# Altium schematic sheet 0-99_Counter.SchDoc
size A; SheetNumber: 1; SheetTotal: 2
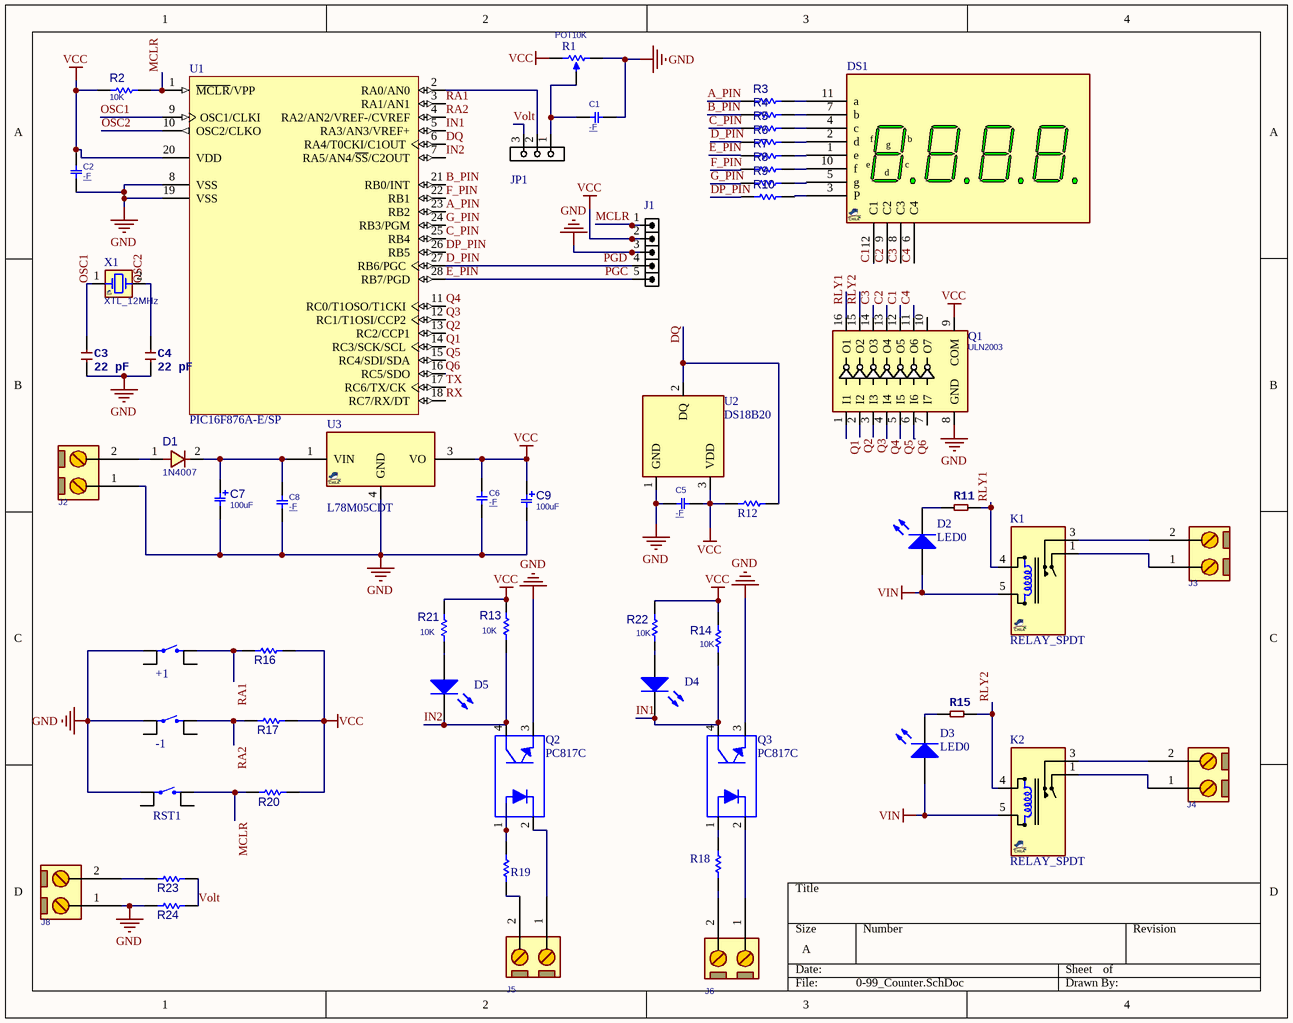
[diagram p0: 0-99_Counter.SchDoc]

## Parts
+1  Tactile 4PIN 6X6mm H5mm (THD)  [SWPBT_SPDT_6X6X5SKHH]  (value not drawn)
-1  Tactile 4PIN 6X6mm H5mm (THD)  [SWPBT_SPDT_6X6X5SKHH]  (value not drawn)
C1  -F  [C0805]
C2  -F  [C0805]
C3  22 pF  [C0603]
C4  22 pF  [C0603]
C5  -F  [C0805]
C6  -F  [C0805]
C7  100uF  [C_EL_10X12]
C8  -F  [C0805]
C9  100uF  [C_EL_10X12]
D1  1N4007  [D_AX04_DO41]
D2  LED0  [LED3MM]
D3  LED0  [LED3MM]
D4  LED1  [LED3MM]  (value not drawn)
D5  LED1  [LED3MM]  (value not drawn)
DS1  7SEG_4DIGIT_CC  [7SEGX4_12]  (value not drawn)
J1  HDR1X5  [HDR_M_1X5]  (value not drawn)
J2  CONN_TB2  [TBG_2]  (value not drawn)
J3  CONN_TB2  [TBG_2]  (value not drawn)
J4  CONN_TB2  [TBG_2]  (value not drawn)
J5  CONN_TB2  [TBG_2]  (value not drawn)
J6  CONN_TB2  [TBG_2]  (value not drawn)
J8  CONN_TB2  [TBG_2]  (value not drawn)
JP1  JMPHDR3PIN  [JP_3]  (value not drawn)
K1  RELAY_SPDT  [REL_SPDT_5_2216]
K2  RELAY_SPDT  [REL_SPDT_5_2216]
Q1  ULN2003  [DIP_16]
Q2  PC817C  [DIP762W50P254L650H458Q4B]
Q3  PC817C  [DIP762W50P254L650H458Q4B]
R1  POT10K  [VOL_R]
R2  10K  [R0805]
R3  10K  [R0805]  (value not drawn)
R4  10K  [R0805]  (value not drawn)
R5  10K  [R0805]  (value not drawn)
R6  10K  [R0805]  (value not drawn)
R7  10K  [R0805]  (value not drawn)
R8  10K  [R0805]  (value not drawn)
R9  10K  [R0805]  (value not drawn)
R10  10K  [R0805]  (value not drawn)
R11  (no value)  [R0805]
R12  10K  [R0805]  (value not drawn)
R13  10K  [R0805]
R14  10K  [R0805]
R15  (no value)  [R0805]
R16  10K  [R0805]  (value not drawn)
R17  10K  [R0805]  (value not drawn)
R18  10K  [R0805]  (value not drawn)
R19  10K  [R0805]  (value not drawn)
R20  10K  [R0805]  (value not drawn)
R21  10K  [R0805]
R22  10K  [R0805]
R23  10K  [R0805]  (value not drawn)
R24  10K  [R0805]  (value not drawn)
RST1  Tactile 4PIN 6X6mm H5mm (THD)  [SWPBT_SPDT_6X6X5SKHH]  (value not drawn)
U1  PIC16F876A-E/SP  [SPDIP300-SP28]
U2  DS18B20  [TO-92-TO92127P495H2044-3]
U3  L78M05CDT  [DPAK_3]
X1  XTL_12MHz  [XTLT_2]

## Nets
GND: +1.1 -1.1 C1.2 C2.1 C3.2 C4.2 C5.2 C6.1 C7.2 C8.1 C9.2 J1.3 J2.1 J8.1 Q1.8(GND) Q2.3 Q3.3 R1.3(BOT) R24.2 RST1.1 U1.8(VSS) U1.19(VSS) U2.1(GND) U3.4(GND)
VCC: C2.2 C5.1 C6.2 C9.1 J1.2 Q1.9(COM) R1.1(TOP) R2.1 R12.2 R13.2 R14.2 R16.2 R17.2 R20.2 R21.2 R22.2 U1.20(VDD) U2.3(VDD) U3.3(VO)
VIN: D2.1(A) D3.1(A) K1.5(T2) K2.5(T2)
A_PIN: R3.1 U1.23(RB2)
B_PIN: R4.1 U1.21(RB0/INT)
C1: DS1.12(C1) Q1.12(O5)
C2: DS1.9(C2) Q1.13(O4)
C3: DS1.8(C3) Q1.14(O3)
C4: DS1.6(C4) Q1.11(O6)
C_PIN: R5.1 U1.25(RB4)
D_PIN: J1.4 R6.1 U1.27(RB6/PGC)  [also labelled PGD]
DP_PIN: R10.1 U1.26(RB5)
DQ: R12.1 U1.6(RA4/T0CKI/C1OUT) U2.2(DQ)
E_PIN: J1.5 R7.1 U1.28(RB7/PGD)  [also labelled PGC]
F_PIN: R8.1 U1.22(RB1)
G_PIN: R9.1 U1.24(RB3/PGM)
IN1: D4.2(K) Q3.4 R14.1 U1.5(RA3/AN3/VREF+)
IN2: D5.2(K) Q2.4 R13.1 U1.7(RA5/AN4/~{SS}/C2OUT)
MCLR: J1.1 R2.2 R20.1 RST1.2 U1.1(~{MCLR}/VPP)
OSC1: C3.1 U1.9(OSC1/CLKI) X1.1(OSC1)
OSC2: C4.1 U1.10(OSC2/CLKO) X1.2(OSC2)
Q1: Q1.1(I1) U1.14(RC3/SCK/SCL)
Q2: Q1.2(I2) U1.13(RC2/CCP1)
Q3: Q1.3(I3) U1.12(RC1/T1OSI/CCP2)
Q4: Q1.4(I4) U1.11(RC0/T1OSO/T1CKI)
Q5: Q1.5(I5) U1.15(RC4/SDI/SDA)
Q6: Q1.6(I6) U1.16(RC5/SDO)
RA1: +1.2 R16.1 U1.3(RA1/AN1)
RA2: -1.2 R17.1 U1.4(RA2/AN2/VREF-/CVREF)
RLY1: K1.4(T1) Q1.16(O1) R11.2
RLY2: K2.4(T1) Q1.15(O2) R15.1
RX: U1.18(RC7/RX/DT)
TX: U1.17(RC6/TX/CK)
Volt: JP1.3 R23.1 R24.1
NetC1_1: C1.1 JP1.1 R1.2(TAP)
NetC7_1: C7.1 C8.2 D1.2 U3.1(VIN)
NetD1_1: D1.1 J2.2
NetD2_2: D2.2(K) R11.1
NetD3_2: D3.2(K) R15.2
NetD4_1: D4.1(A) R22.1
NetD5_1: D5.1(A) R21.1
NetDS1_1: DS1.1(e) R7.2
NetDS1_2: DS1.2(d) R6.2
NetDS1_3: DS1.3(P) R10.2
NetDS1_4: DS1.4(c) R5.2
NetDS1_5: DS1.5(g) R9.2
NetDS1_7: DS1.7(b) R4.2
NetDS1_10: DS1.10(f) R8.2
NetDS1_11: DS1.11(a) R3.2
NetJ3_1: J3.1 K1.1(COM)
NetJ3_2: J3.2 K1.3(NO)
NetJ4_1: J4.1 K2.1(COM)
NetJ4_2: J4.2 K2.3(NO)
NetJ5_1: J5.1 Q2.2
NetJ5_2: J5.2 R19.2
NetJ6_1: J6.1 Q3.2
NetJ6_2: J6.2 R18.1
NetJ8_2: J8.2 R23.2
NetJP1_2: JP1.2 U1.2(RA0/AN0)
NetQ2_1: Q2.1 R19.1
NetQ3_1: Q3.1 R18.2

Not connected (* = marked no-connect by the designer): +1 3 4; -1 3 4; Q1 7(I7) 10(O7); RST1 3 4

## Library data of the parts
+1 -1 RST1 = Tactile 4PIN 6X6mm H5mm (THD): Tactile Switch SPST-NO Top Actuated Surface Mount; PartNumber: PTS645SH50SMTR92 LFS
C1 C2 C5 C6 C8 = CAP_SMD_MLCC_0805: CAP, MLCC, -F, -V, MATERIAL, -%, 0201; PARAM: -, -%; MANF_P#: MANF_PART#; PRICE: 100= 1$; MANF: -; PARAM2: -V; ASSEMBLY: ASSEMBLY; VALUE: -F
C3 C4 = CERAMIC-1NF-50V-5%-C0G(0603): MPN: GRM1885C1H102JA01D
C7 C9 = CAP_THD_EL: CAP, THD, ELEC,; MANF_P#: MANF_PART#; PARAM2: 20%; DESC: DESCRIPTION; DIST#: MOUSER; PARAM: 25V; PRICE: 10= 5$; MANF: MANF; ASSEMBLY: ASSEMBLY; VALUE: 100uF
D1 = DIODE_THD_1N4007: DIODE, GENERAL PURPOSE, 1000V/1A; MANF: Diodes; DESC: DESCRIPTION; PARAM: 1000V, 1.15V; PARAM2: 1.5A; ASSEMBLY: ASSEMBLY; PRICE: PRICE; MANF_P#: 1N4007; VALUE: 1N4007
D2 D3 = LED0: Typical INFRARED GaAs LED; Published: 8-Jun-2000; LatestRevisionDate: 08-Jul-2005; LatestRevisionNote: Mech Layer 1 removed.; PackageReference: LED-0; Publisher: Altium Limited; PackageDescription: LED; 2 Leads
D4 D5 = LED1: Typical RED GaAs LED; Published: 8-Jun-2000; LatestRevisionDate: 08-Jul-2005; LatestRevisionNote: Mech Layer 1 removed.; PackageReference: LED-1; Publisher: Altium Limited; PackageDescription: LED; 2 Leads
DS1 = 7SEG_4DIGIT_CC: 7SEGMENT, 4DIGIT, common cathode 5641; MANF_P#: DPY-4CK; VALUE: 7SEG_4DIGIT_CC
J1 = HDR_M_1X5: CONN, HEADER, Male, pitch: 2.54mm, 5POS; VALUE: HDRM5
J2-J6 J8 = CONN_TB2: CONN, TERMINAL BLOCK, 5.08mm pitch; VALUE: CONN_TB2
JP1 = JUMPER_HDR_3P: JUMPER, HEADER 3PIN; MANF: MANF; MANF_P#: MANF_P#; VALUE: JMPHDR3PIN
K1 K2 = RELAY_SPST_5_2216_G5LE: Relay, SPDT, 5P, 22X16mm, 120V/10A; MANF: OMRON; MANF_P#: G5LE-1; PARAM2: 250VAC, 10A; PARAM: 12V, 50mA; PRICE: PRICE; Value: RELAY_SPDT
Q1 = ULN2004_DIP16: Darlington, 7-CH, 50V, 0.5A, 6~15V CMOS/PMOS; MANF_P#: ULN2004A; MANF: ST; PARAM: 7-CH, 50V, 0.5A; PARAM2: 6~15V CMOS/PMOS; VALUE: ULN2003
Q2 Q3 = PC817C: Optoisolator Transistor Output 5000Vrms 1 Channel 4-DIP; MF: Taiwan Semiconductor; Value: *; Availability: Unavailable; SnapEDA_Link: https://www.snapeda.com/parts/PC817C/Taiwan%20Semiconductor%20Corporation/view-part/2816187/?ref=snap; Package: DIP-4 Taiwan Semiconductor; MP: PC817C; Price: None
R1 = RES_THD_POT_VOL: RESISTOR, THD, Potentiometer Volume; VALUE: POT10K
R2-R10 R13 R14 R17 R20-R24 = RES_THD: RESISTOR, THD; MANF_P#: RK73H1ETTP4701F; MANF: KOA SPEER; PARAM: 0.063W; DESC: DESCRIPTION; DIST#: MOUSER; PARAM2: 1%; ASSEMBLY: ASSEMBLY; PRICE: 100= 0.5$; VALUE: 10K
R11 R15 = RES_THT
R12 R16 R18 R19 = RES_THD: RESISTOR, THD 4K7; MANF_P#: RK73H1ETTP4701F; MANF: KOA SPEER; PARAM: 0.063W; DESC: DESCRIPTION; DIST#: MOUSER; PARAM2: 1%; ASSEMBLY: ASSEMBLY; PRICE: 100= 0.5$; VALUE: 10K
U1 = PIC16F876A-E/SP: Enhanced FLASH Microcontroller, 8K (x14-Bit words) FLASH, 368 Bytes RAM, 28-Pin PDIP 300mil, Standard VDD Range, Extended Temperature; ComponentAvailability: Unknown. Contact manufacturer to determine status.; Published: 11-Oct-2004; LatestRevisionDate: 29-Jan-2009; LatestRevisionNote: Sch. layout revised. 3D Model Removed.; DatasheetVersion: revB, Oct-2003; PackageVersion: revBB, Aug-2009; PackageReference: SPDIP300-SP28; Publisher: Altium Limited; PackageDescription: 28-Lead Skinny Plastic Dual In-Line (SP) - 300 mil Body [SPDIP]; Supplier 1: Digi-Key; Supplier Part Number 1: PIC16F876A-E/SP-ND; ComponentLink1Description: Datasheet; ComponentLink1URL: http://ww1.microchip.com/downloads/en/DeviceDoc/39582b.pdf; ComponentLink2Description: Packaging Specification; ComponentLink2URL: http://www.microchip.com/stellent/groups/techpub_sg/documents/packagingspec/en012702.pdf; ComponentLink3Description: Microchip.com Home; ComponentLink3URL: http://www.microchip.com/
U2 = DS18B20: Temperature Sensor Digital, Local -55Â°C ~ 125Â°C 12 b TO-92-3; MF: Maxim Integrated; Package: TO-92 Maxim Integrated; Value: *; Price: None; MP: DS18B20; Availability: Unavailable; SnapEDA_Link: https://www.snapeda.com/parts/DS18B20/Maxim%20Integrated/view-part/1266091/?ref=snap
U3 = VREG_78M05_TO252: REG, Linear, Fixed, 5v, 0.5A, TO-252; MANF_P#: LM78M05CDT, L7805CDT, MC7805BDT, MC78M05CDT, MC7805BDT, KA7805ERT, NCV7805BDT, BA7805FP, NJM7805DL1A, AS7805ADTR; MANF: TI, ST, FAIRCHILD, ON, NJR, ROHM, DIODES; PARAM: 5v, 0.5A; PARAM2: PARAM2; VALUE: L78M05CDT
X1 = XTL_2_HC49_SMD: Crystal MOST POPULAR ABL HC49 PACKAGE; VALUE: XTL_12MHz